# EAGLE schematic knock_board (EAGLE 7.5.0)
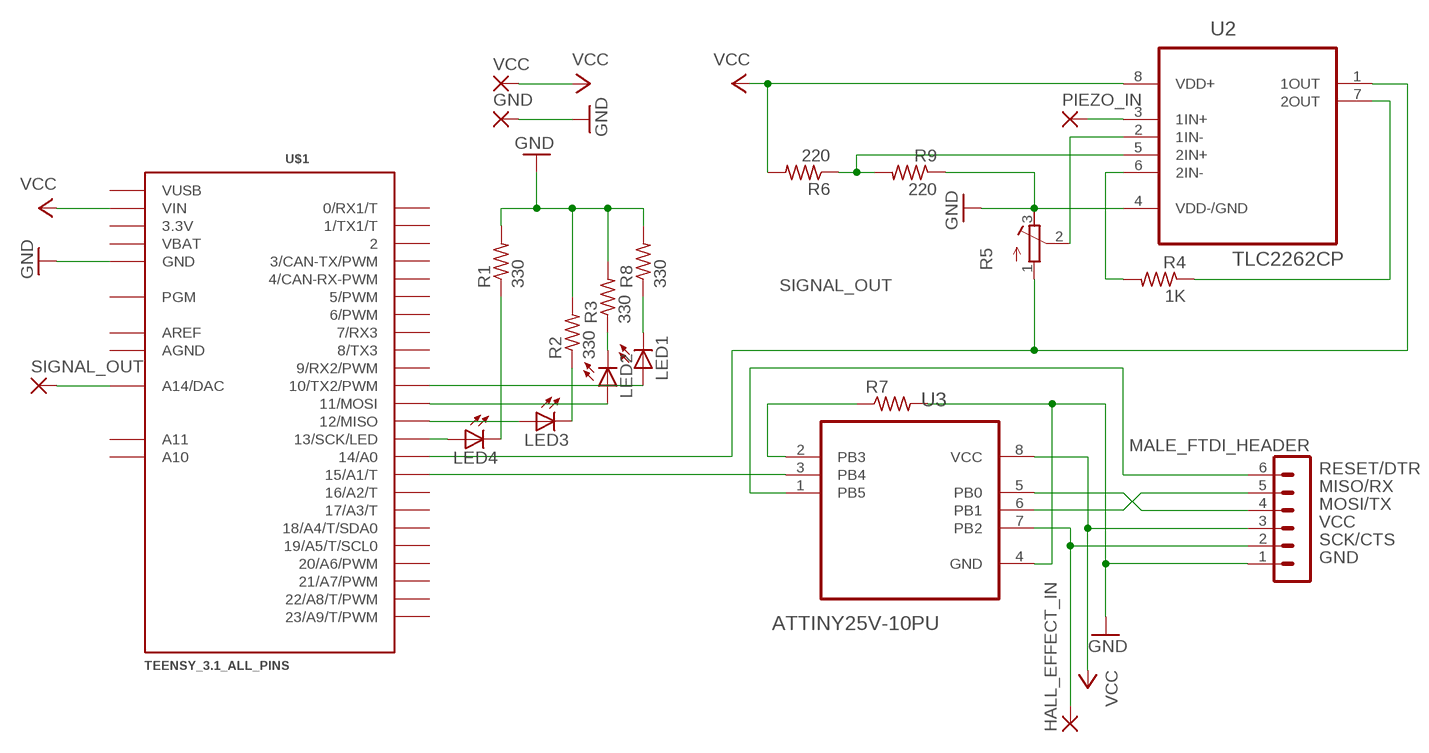
[diagram p0: schematic, sheet 1]

## Parts
GND  2,54/1,1  [2,54/1,1]
HALL_EFFECT_IN  2,54/1,1  [2,54/1,1]
LED1  LED3MM  [LED3MM]
LED2  LED3MM  [LED3MM]
LED3  LED3MM  [LED3MM]
LED4  LED3MM  [LED3MM]
MALE_FTDI_HEADER  MA06-1  [MA06-1]
PIEZO_IN  2,54/1,1  [2,54/1,1]
R1  330  R-US_0204/5  [0204/5]
R2  330  R-US_0204/5  [0204/5]
R3  330  R-US_0204/5  [0204/5]
R4  1K  R-US_0204/5  [0204/5]
R5  R-TRIMM4G/J  [RTRIM4G/J]
R6  220  R-US_0204/5  [0204/5]
R7  R-US_0204/7  [0204/7]
R8  330  R-US_0204/5  [0204/5]
R9  220  R-US_0204/5  [0204/5]
SIGNAL_OUT  2,54/1,1  [2,54/1,1]
U2  TLC2262CP  [DIP254P762X508-8]
U3  ATTINY25V-10PU  [DIP254P762X533-8]
U$1  TEENSY_3.1_ALL_PINS  [TEENSY3-ALL_PINS]
VCC  2,54/1,1  [2,54/1,1]

## Nets
GND: GND.1(P) MALE_FTDI_HEADER.1 R1.2 R2.2 R3.2 R5.3(E) R7.2 R8.2 R9.1 U2.4(VDD-/GND) U3.4(GND) U$1.GND U$1.GND1(GND)
IN_KNOCK-ZONE-OUT: U3.3(PB4) U$1.15/A1(15/A1/T)
MISO/RX: MALE_FTDI_HEADER.5 U3.6(PB1)
MOSI/TX: MALE_FTDI_HEADER.4 U3.5(PB0)
N$1: SIGNAL_OUT.1(P) U$1.RESET/DAC(A14/DAC)
N$2: PIEZO_IN.1(P) U2.3(1IN+)
N$3: R5.2(S) U2.2(1IN-)
N$4: R4.2 U2.6(2IN-)
N$5: LED4.A U$1.13(13/SCK/LED)
N$6: R6.1 R9.2 U2.5(2IN+)
N$7: R7.1 U3.2(PB3)
N$8: LED3.A U$1.12(12/MISO)
N$9: LED2.A U$1.11(11/MOSI)
N$10: LED1.A U$1.10(10/TX2/PWM)
N$11: LED4.K(C) R1.1
N$12: LED3.K(C) R2.1
N$13: LED2.K(C) R3.1
N$14: LED1.K(C) R8.1
N$15: R4.1 U2.7(2OUT)
RESET/DTR: MALE_FTDI_HEADER.6 U3.1(PB5)
SCK/CTS: HALL_EFFECT_IN.1(P) MALE_FTDI_HEADER.2 U3.7(PB2)
SIGNAL_OUT: R5.1(A) U2.1(1OUT) U$1.14/A0
VCC: MALE_FTDI_HEADER.3 R6.2 U2.8(VDD+) U3.8(VCC) U$1.VIN VCC.1(P)
Unconnected: U$1.0(0/RX1/T) U$1.1(1/TX1/T) U$1.2 U$1.3(3/CAN-TX/PWM) U$1.4(4/CAN-RX-PWM) U$1.5(5/PWM) U$1.6(6/PWM) U$1.7(7/RX3) U$1.8(8/TX3) U$1.9(9/RX2/PWM) U$1.16/A2(16/A2/T) U$1.17/A3(17/A3/T) U$1.18/A4(18/A4/T/SDA0) U$1.19/A5(19/A5/T/SCL0) U$1.20/A6(20/A6/PWM) U$1.21/A7(21/A7/PWM) U$1.22/A8(22/A8/T/PWM) U$1.23/A9(23/A9/T/PWM) U$1.A10 U$1.A11 U$1.PGM

## Power pins joined to a net without a drawn wire
3.3V: U$1.3.3V U$1.3.3V1(3.3V)
AGND: U$1.AGND
AREF: U$1.AREF
VBAT: U$1.VBAT
VUSB: U$1.VUSB

## Library data of the parts
GND HALL_EFFECT_IN PIEZO_IN SIGNAL_OUT VCC = wirepad:2,54/1,1: THROUGH-HOLE PAD
LED1-LED4 = led:LED: LED OSRAM: - CHIPLED LG R971, LG N971, LY N971, LG Q971, LY Q971, LO R971, LY R971 LH N974, LH R974 LS Q976, LO Q976, LY Q976 LO Q996 - Hyper CHIPLED LW Q18S LB Q993, LB Q99A, LB R99A - SideLED LS A670, LO A670, LY A670, LG A670, LP A670 LB A673, LV A673, LT A673, LW A673 LH A674 LY A675 LS A676, LA A676, LO A676, LY A676, LW A676 LS A679, LY A679, LG A679 - Hyper Micro SIDELED® LS Y876, LA Y876, LO Y876, LY Y876 LT Y87S - SmartLED LW L88C, LW L88S LB L89C, LB L89S, LG L890 LS L89K, LO L89K, LY L89K LS L896, LA L896, LO L896, LY L896 - TOPLED LS T670, LO T670, LY T670, LG T670, LP T670 LSG T670, LSP T670, LSY T670, LOP T670, LYG T670 LG T671, LOG T671, LSG T671 LB T673, LV T673, LT T673, LW T673 LH T674 LS T676, LA T676, LO T676, LY T676, LB T676, LH T676, LSB T676, LW T676 LB T67C, LV T67C, LT T67C, LS T67K, LO T67K, LY T67K, LW E67C LS E67B, LA E67B, LO E67B, LY E67B, LB E67C, LV E67C, LT E67C LW T67C LS T679, LY T679, LG T679 LS T770, LO T770, LY T770, LG T770, LP T770 LB T773, LV T773, LT T773, LW T773 LH T774 LS E675, LA E675, LY E675, LS T675 LS T776, LA T776, LO T776, LY T776, LB T776 LHGB T686 LT T68C, LB T68C - Hyper Mini TOPLED® LB M676 - Mini TOPLED Santana® LG M470 LS M47K, LO M47K, LY M47K Source: http://www.osram.convergy.de LUXEON: - LUMILED® LXK2-PW12-R00, LXK2-PW12-S00, LXK2-PW14-U00, LXK2-PW14-V00 LXK2-PM12-R00, LXK2-PM12-S00, LXK2-PM14-U00 LXK2-PE12-Q00, LXK2-PE12-R00, LXK2-PE12-S00, LXK2-PE14-T00, LXK2-PE14-U00 LXK2-PB12-K00, LXK2-PB12-L00, LXK2-PB12-M00, LXK2-PB14-N00, LXK2-PB14-P00, LXK2-PB14-Q00 LXK2-PR12-L00, LXK2-PR12-M00, LXK2-PR14-Q00, LXK2-PR14-R00 LXK2-PD12-Q00, LXK2-PD12-R00, LXK2-PD12-S00 LXK2-PH12-R00, LXK2-PH12-S00 LXK2-PL12-P00, LXK2-PL12-Q00, LXK2-PL12-R00 Source: www.luxeon.com KINGBRIGHT: KA-3528ASYC Source: www.kingbright.com
MALE_FTDI_HEADER = con-lstb:MA06-1: PIN HEADER; OC_FARNELL: unknown; OC_NEWARK: unknown
R1-R4 R6-R9 = rcl:R-US_: RESISTOR, American symbol
R5 = rcl:R-TRIMM: Trimm resistor
U2 = Texas Instruments_By_element14_Batch_1:TLC2262CP: OPERATIONAL AMPLIFIER; MPN: TLC2262CP; OC_FARNELL: 8453799; OC_NEWARK: 35K1181; PACKAGE: PDIP; SUPPLIER: Texas Instruments
U3 = Atmel_By_element14_Batch_1-00:ATTINY25V-10PU: 8-bit Microcontroller with 2/4/8KBytes In-System Programmable Flash; MPN: ATTINY25V-10PU; OC_FARNELL: 1455144; OC_NEWARK: 58M3780; PACKAGE: PDIP-8; SUPPLIER: Atmel
U$1 = teensy:TEENSY_3.1_ALL_PINS: Footprint for Teensy 3.1 or 3.2 board using all through-holes, i.e. the entire perimeter plus the 4 through-holes inboard (A10,A11,AREF, VUSB)